# EAGLE schematic schematic (EAGLE 7.3.0)
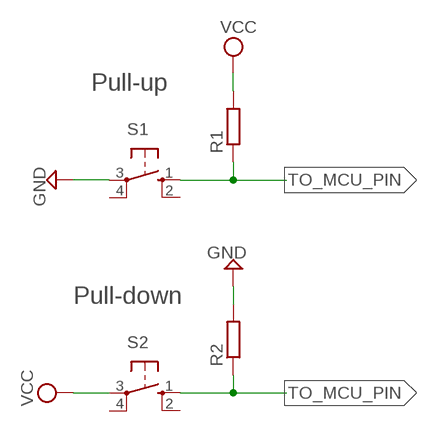
[diagram p0: schematic, sheet 1]

## Parts
R1  R0204/7  [0204/7]
R2  R0204/7  [0204/7]
S1  10-XX  [B3F-10XX]
S2  10-XX  [B3F-10XX]

## Nets
GND: R2.2
TO_MCU_PIN: R1.1 R2.1 S1.1(S) S2.1(S)
VCC: R1.2 S2.3(P)
Unconnected: S1.2(S1) S1.3(P) S1.4(P1) S2.2(S1) S2.4(P1)

## Notes on the sheet
- Pull-up
- Pull-down

## Library data of the parts
R1 R2 = eagle-ltspice:R: RESISTOR, European symbol; SPICEMODEL: NONE; SPICEPREFIX: R
S1 S2 = switch-omron:10-XX: OMRON SWITCH; MPN: B3F-1000; OC_FARNELL: 176432; OC_NEWARK: 36M3542